# EAGLE design untitled (EAGLE 6.5.0)

## Sheet 1 of 2
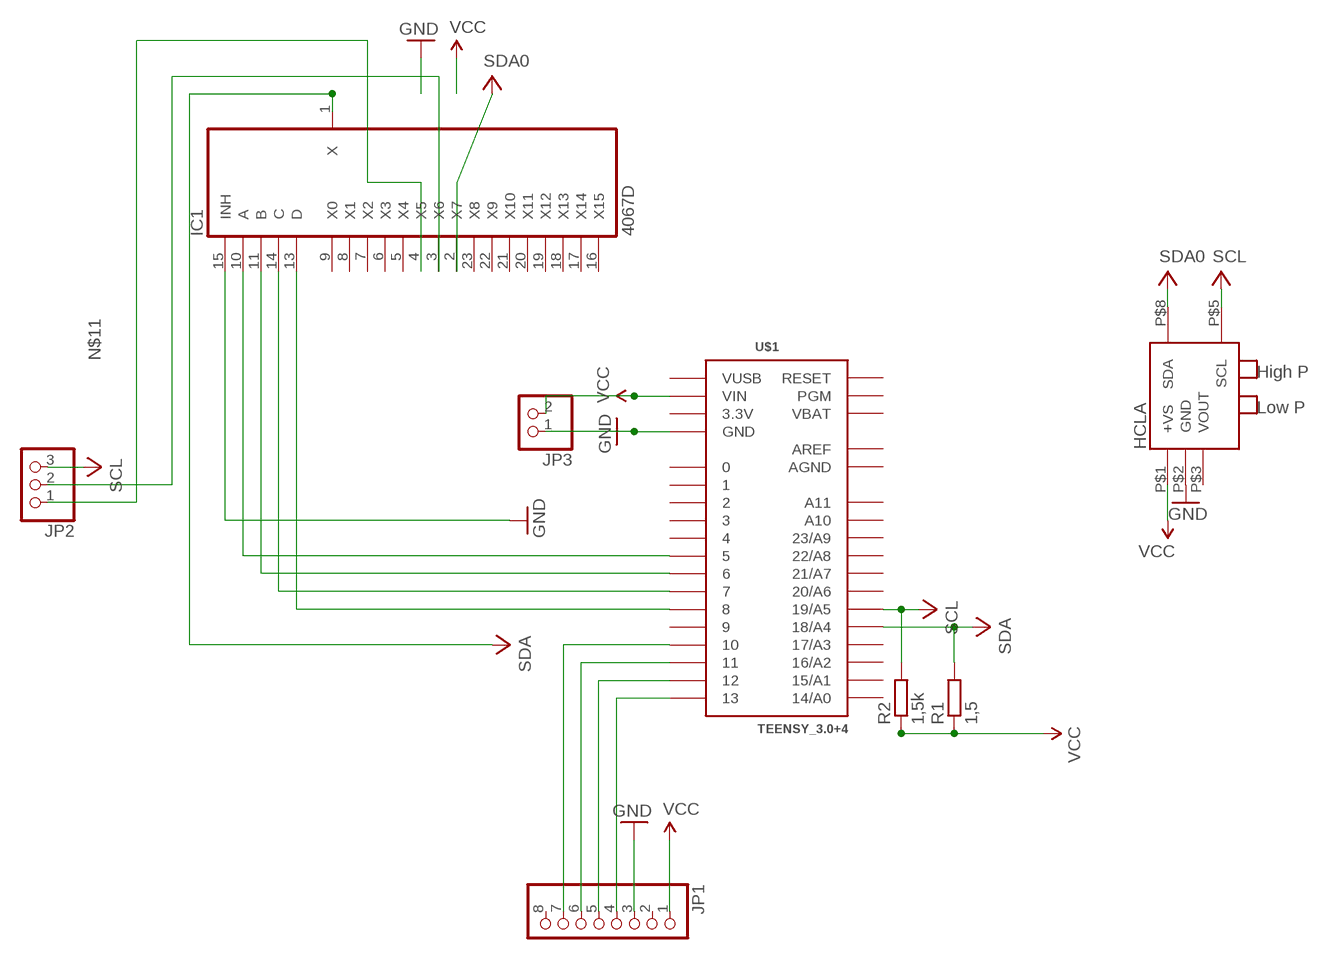
[diagram p0: schematic, sheet 1]

### Parts
IC1  4067D  [SO24W]
JP1  PINHD-1X8  [1X08]
JP2  PINHD-1X3  [1X03]
JP3  PINHD-1X2  [1X02]
R1  1,5  R-EU_0204/5  [0204/5]
R2  1,5k  R-EU_0204/5  [0204/5]
U$1  TEENSY_3.0+4  [TEENSY_3.0+4]
U$2  HCLA  [HCLA]

### Nets
GND: IC1.15(INH) JP1.3 JP3.1 U$1.GND U$1.GND1(GND) U$2.P$2(GND)
N$1: IC1.10(A) U$1.5
N$2: IC1.11(B) U$1.6
N$3: IC1.14(C) U$1.7
N$4: IC1.13(D) U$1.8
N$5: JP1.7 U$1.10
N$6: JP1.6 U$1.11
N$7: JP1.5 U$1.12
N$8: JP1.4 U$1.13
N$10: IC1.4(X5) JP2.1
N$11: IC1.3(X6) JP2.2
SCL: JP2.3 R2.2 U$1.19/A5 U$2.P$5(SCL)
SDA: IC1.1(X) R1.2 U$1.18/A4
SDA0: IC1.2(X7) U$2.P$8(SDA)
VDD: JP1.1 JP3.2 R1.1 R2.1 U$1.VIN U$2.P$1(+VS) ; supply symbol labelled VCC
Unconnected: IC1.5(X4) IC1.6(X3) IC1.7(X2) IC1.8(X1) IC1.9(X0) IC1.16(X15) IC1.17(X14) IC1.18(X13) IC1.19(X12) IC1.20(X11) IC1.21(X10) IC1.22(X9) IC1.23(X8) JP1.2 JP1.8 U$1.0 U$1.1 U$1.2 U$1.3 U$1.4 U$1.9 U$1.14/A0 U$1.15/A1 U$1.16/A2 U$1.17/A3 U$1.20/A6 U$1.21/A7 U$1.22/A8 U$1.23/A9 U$1.A10 U$1.A11 U$1.PGM U$1.RESET U$2.P$3(VOUT)

## Sheet 2 of 2
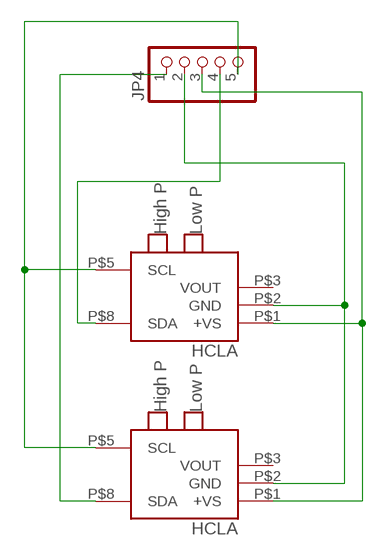
[diagram p1: schematic, sheet 2]

### Parts
JP4  PINHD-1X5  [1X05]
U$3  HCLA  [HCLA]
U$4  HCLA  [HCLA]

### Nets
N$9: JP4.5 U$3.P$5(SCL) U$4.P$5(SCL)
N$12: JP4.3 U$3.P$1(+VS) U$4.P$1(+VS)
N$13: JP4.2 U$3.P$2(GND) U$4.P$2(GND)
N$14: JP4.4 U$3.P$8(SDA)
N$15: JP4.1 U$4.P$8(SDA)
Unconnected: U$3.P$3(VOUT) U$4.P$3(VOUT)

## Power pins joined to a net without a drawn wire
3.3V: U$1.3.3V U$1.3.3V1(3.3V)
AGND: U$1.AGND
AREF: U$1.AREF
VBAT: U$1.VBAT
VDD: IC1.24(VDD)
VSS: IC1.12(VSS)
VUSB: U$1.VUSB

## Library data of the parts
IC1 = 40xx:4067: 16-channel ANALOG MULTIPLEXER
JP1 = pinhead:PINHD-1X8: PIN HEADER
JP2 = pinhead:PINHD-1X3: PIN HEADER
JP3 = pinhead:PINHD-1X2: PIN HEADER
JP4 = pinhead:PINHD-1X5: PIN HEADER
R1 R2 = rcl:R-EU_: RESISTOR, European symbol
U$1 = Teensy3.0:TEENSY_3.0+4: Teensy 3.0 board, showing all pins that are easily acessible. See 'AllAnalogPins" and 'AllPins' packages for additional pin holes, as needed. The 'Basic' package has fewer pins.
U$2-U$4 = HCLA:HCLA

## Board
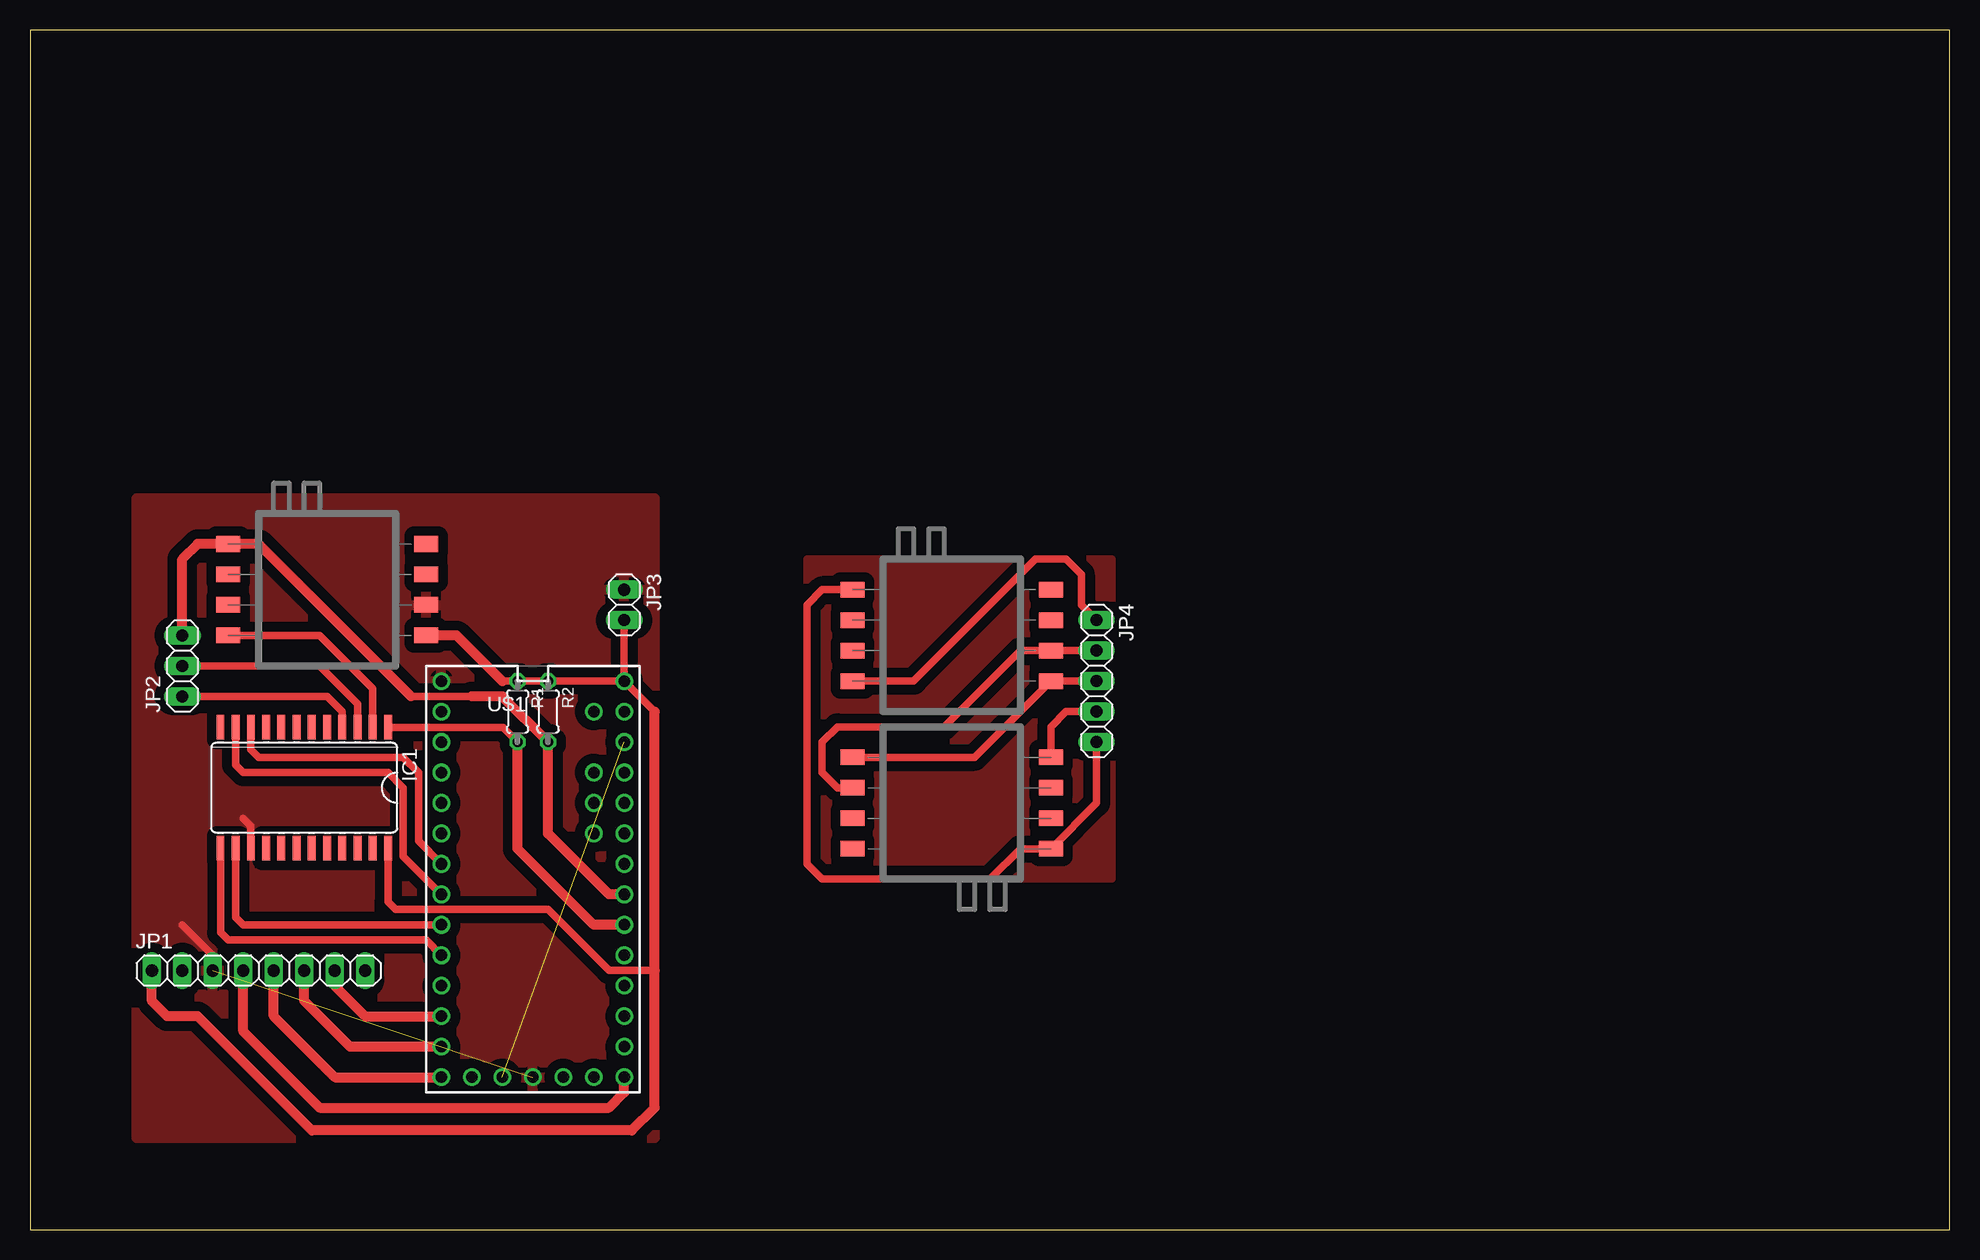
[diagram p2: board, top side]

Size 160 x 100 mm. Coordinates in mm from the lower left corner, seen from the top.
Outline: 0,0 160,0 160,100 0,100 0,0
Copper layers (1*16): Top 0.035mm / dielectric 1.5mm / Bottom 0.035mm
Design rules "default": minimum track width 10mil, minimum drill 24mil, track to track 8mil, track to pad 8mil, pad to pad 8mil, via to via 8mil, smd to smd 8mil, copper to edge 40mil, drill to drill 8mil, minimum pad ring 10mil, minimum via ring 8mil, stop-mask expansion 4mil, vias tented up to drill 0mil, thermal gap 10mil

### Footprints (pad centres in the part's own frame; a part is rotated, then mirrored left to right if it is on the bottom)
SO24W = smd 0.66 x 2.032: 1 -6.985,-5.029; 2 -5.715,-5.029; 3 -4.445,-5.029; 4 -3.175,-5.029; 5 -1.905,-5.029; 6 -0.635,-5.029; 7 0.635,-5.029; 8 1.905,-5.029; 9 3.175,-5.029; 10 4.445,-5.029; 11 5.715,-5.029; 12 6.985,-5.029; 13 6.985,5.029; 14 5.715,5.029; 15 4.445,5.029; 16 3.175,5.029; 17 1.905,5.029; 18 0.635,5.029; 19 -0.635,5.029; 20 -1.905,5.029; 21 -3.175,5.029; 22 -4.445,5.029; 23 -5.715,5.029; 24 -6.985,5.029
1X08 = drill 1.016 long: 1 -8.89,0; 2 -6.35,0; 3 -3.81,0; 4 -1.27,0; 5 1.27,0; 6 3.81,0; 7 6.35,0; 8 8.89,0
1X03 = drill 1.016 long: 1 -2.54,0; 2 0,0; 3 2.54,0
1X02 = drill 1.016 long: 1 -1.27,0; 2 1.27,0
1X05 = drill 1.016 long: 1 -5.08,0; 2 -2.54,0; 3 0,0; 4 2.54,0; 5 5.08,0
0204/5 = drill 0.813 octagon: 1 -2.54,0; 2 2.54,0
TEENSY_3.0+4 = drill 0.965: 0 -7.62,13.97; 1 -7.62,11.43; 2 -7.62,8.89; 3 -7.62,6.35; 3.3V 7.62,11.43; 3.3V1 -2.54,-16.51; 4 -7.62,3.81; 5 -7.62,1.27; 6 -7.62,-1.27; 7 -7.62,-3.81; 8 -7.62,-6.35; 9 -7.62,-8.89; 10 -7.62,-11.43; 11 -7.62,-13.97; 12 -7.62,-16.51; 13 7.62,-16.51; 14/A0 7.62,-13.97; 15/A1 7.62,-11.43; 16/A2 7.62,-8.89; 17/A3 7.62,-6.35; 18/A4 7.62,-3.81; 19/A5 7.62,-1.27; 20/A6 7.62,1.27; 21/A7 7.62,3.81; 22/A8 7.62,6.35; 23/A9 7.62,8.89; A10 5.08,6.35; A11 5.08,3.81; AGND 7.62,13.97; AREF 5.08,8.89; GND -7.62,16.51; GND1 0,-16.51; PGM 2.54,-16.51; RESET 5.08,-16.51; VBAT -5.08,-16.51; VIN 7.62,16.51; VUSB 5.08,13.97
HCLA = smd 1.3 x 2: P$1 -3.81,-7.62; P$2 -1.27,-7.62; P$3 1.27,-7.62; P$4 3.81,-7.62; P$5 3.81,8.89; P$6 1.27,8.89; P$7 -1.27,8.89; P$8 -3.81,8.89

### Placement (x,y rotation side)
IC1  22.86,36.83 180 top
JP1  19.05,21.59 0 top
JP2  12.7,46.99 90 top
JP3  49.53,52.07 270 top
JP4  88.9,45.72 270 top
R1  40.64,43.18 270 top
R2  43.18,43.18 270 top
U$1  41.91,29.21 0 top
U$2  25.4,53.34 90 top
U$3  76.2,35.56 270 top
U$4  77.47,49.53 90 top

### Tracks (layer width: path | path; a pad name or v marks a point on that pad's centre or on a via)
3.3V  (1 unrouted)
GND  (1 unrouted)
  Top 0.61: IC1.15 18.41,33.66 17.78,34.29 | JP1.3 15.24,22.86 12.7,25.4
  pour Top (isolate 0.813): 52.07,7.62 8.89,7.62 8.89,60.96 52.07,60.96
N$1
  Top 0.61: U$1.5 32.38,32.38 32.38,38.1 31.11,39.37 19.05,39.37 18.41,40.01 IC1.10
N$2
  Top 0.61: U$1.6 31.11,31.11 31.11,36.83 29.84,38.1 17.78,38.1 17.14,38.73 IC1.11
N$3
  Top 0.61: U$1.7 17.78,25.4 17.14,26.04 IC1.14
N$4
  Top 0.61: U$1.8 33.02,24.13 16.51,24.13 15.88,24.77 IC1.13
N$5
  Top 0.813: U$1.10 27.94,17.78 25.4,20.32 JP1.7
N$6
  Top 0.813: U$1.11 26.67,15.24 22.86,19.05 JP1.6
N$7
  Top 0.813: U$1.12 25.4,12.7 20.32,17.78 JP1.5
N$8
  Top 0.813: U$1.13 49.53,11.43 48.26,10.16 24.13,10.16 17.78,16.51 JP1.4
N$9
  Top 0.61: JP4.5 88.9,35.56 U$3.P$5 82.55,31.75 80.01,29.21 66.04,29.21 64.77,30.48 64.77,52.07 66.04,53.34 U$4.P$5
N$10
  Top 0.61: JP2.1 24.77,44.45 26.04,43.18 IC1.4
N$11
  Top 0.61: JP2.2 24.13,46.99 27.3,43.81 IC1.3
N$12
  Top 0.61: U$3.P$1 78.74,39.37 U$4.P$1 JP4.3
N$13
  Top 0.61: U$3.P$2 67.31,36.83 66.04,38.1 66.04,40.64 67.31,41.91 76.2,41.91 82.55,48.26 U$4.P$2 JP4.2
N$14
  Top 0.61: U$3.P$8 85.09,41.91 86.36,43.18 JP4.4
N$15
  Top 0.61: U$4.P$8 73.66,45.72 83.82,55.88 86.36,55.88 87.63,54.61 87.63,52.07 JP4.1
N$16
  pour Top (isolate 0.813): 64.77,29.21 90.17,29.21 90.17,55.88 64.77,55.88
SCL
  Top 0.61: 31.75,44.45 36.83,44.45
  Top 0.813: U$1.19/A5 48.26,27.94 43.18,33.02 R2.2 39.37,44.45 36.83,44.45 | 31.75,44.45 19.05,57.15 U$2.P$5 13.97,57.15 12.7,55.88 JP2.3
SDA
  Top 0.61: R1.2 39.42,41.86 IC1.1
  Top 0.813: R1.2 40.64,31.75 46.99,25.4 U$1.18/A4
SDA0
  Top 0.406: 22.86,49.53 U$2.P$8
  Top 0.61: U$2.P$8 24.13,49.53 28.57,45.09 IC1.2
VDD  (1 unrouted)
  Top 0.406: 32.38,26.67 43.18,26.67
  Top 0.61: IC1.24 29.84,27.3 30.48,26.67 43.18,26.67 48.26,21.59 52.07,21.59 | U$1.VIN 52.07,43.18 | U$1.VIN R1.1 39.37,45.72 | JP3.2 U$1.VIN
  Top 0.813: 39.37,45.72 35.56,49.53 U$2.P$1 | 52.07,43.18 52.07,21.59 52.07,10.16 50.16,8.26 23.5,8.26 13.97,17.78 11.43,17.78 10.16,19.05 JP1.1 10.16,20.32

### Text on the board
_tNames: JP3 | JP4 | R1 | R2 | JP2 | U$1 | IC1 | JP1